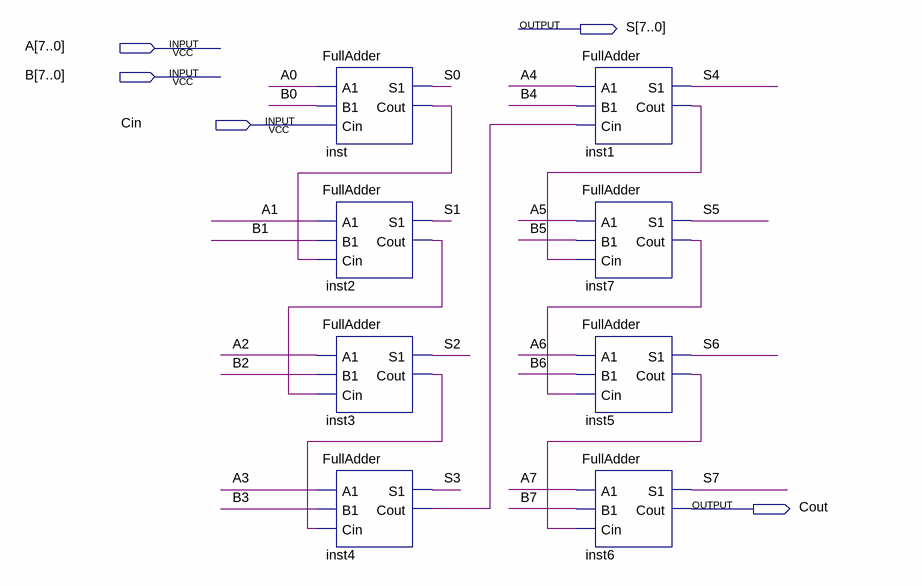
[diagram p0: schematic sheet]
// Quartus schematic RCA.bdf as structural Verilog: 8 symbols, 5 pins
module RCA (
  input  [7:0] A,
  input  [7:0] B,
  input  Cin,
  output [7:0] S,
  output Cout
);

  wire inst1_cout, inst2_cout, inst3_cout, inst4_cout, inst5_cout, inst7_cout, inst_cout;

  FullAdder inst (.A1(A[0]), .B1(B[0]), .Cin(Cin), .S1(S[0]), .Cout(inst_cout));
  FullAdder inst2 (.A1(A[1]), .B1(B[1]), .Cin(inst_cout), .S1(S[1]), .Cout(inst2_cout));
  FullAdder inst3 (.A1(A[2]), .B1(B[2]), .Cin(inst2_cout), .S1(S[2]), .Cout(inst3_cout));
  FullAdder inst4 (.A1(A[3]), .B1(B[3]), .Cin(inst3_cout), .S1(S[3]), .Cout(inst4_cout));
  FullAdder inst1 (.A1(A[4]), .B1(B[4]), .Cin(inst4_cout), .S1(S[4]), .Cout(inst1_cout));
  FullAdder inst7 (.A1(A[5]), .B1(B[5]), .Cin(inst1_cout), .S1(S[5]), .Cout(inst7_cout));
  FullAdder inst5 (.A1(A[6]), .B1(B[6]), .Cin(inst7_cout), .S1(S[6]), .Cout(inst5_cout));
  FullAdder inst6 (.A1(A[7]), .B1(B[7]), .Cin(inst5_cout), .S1(S[7]), .Cout(Cout));
endmodule
